# Altium schematic sheet Sheet1.SchDoc
size A; SheetNumber: 1; SheetTotal: 5
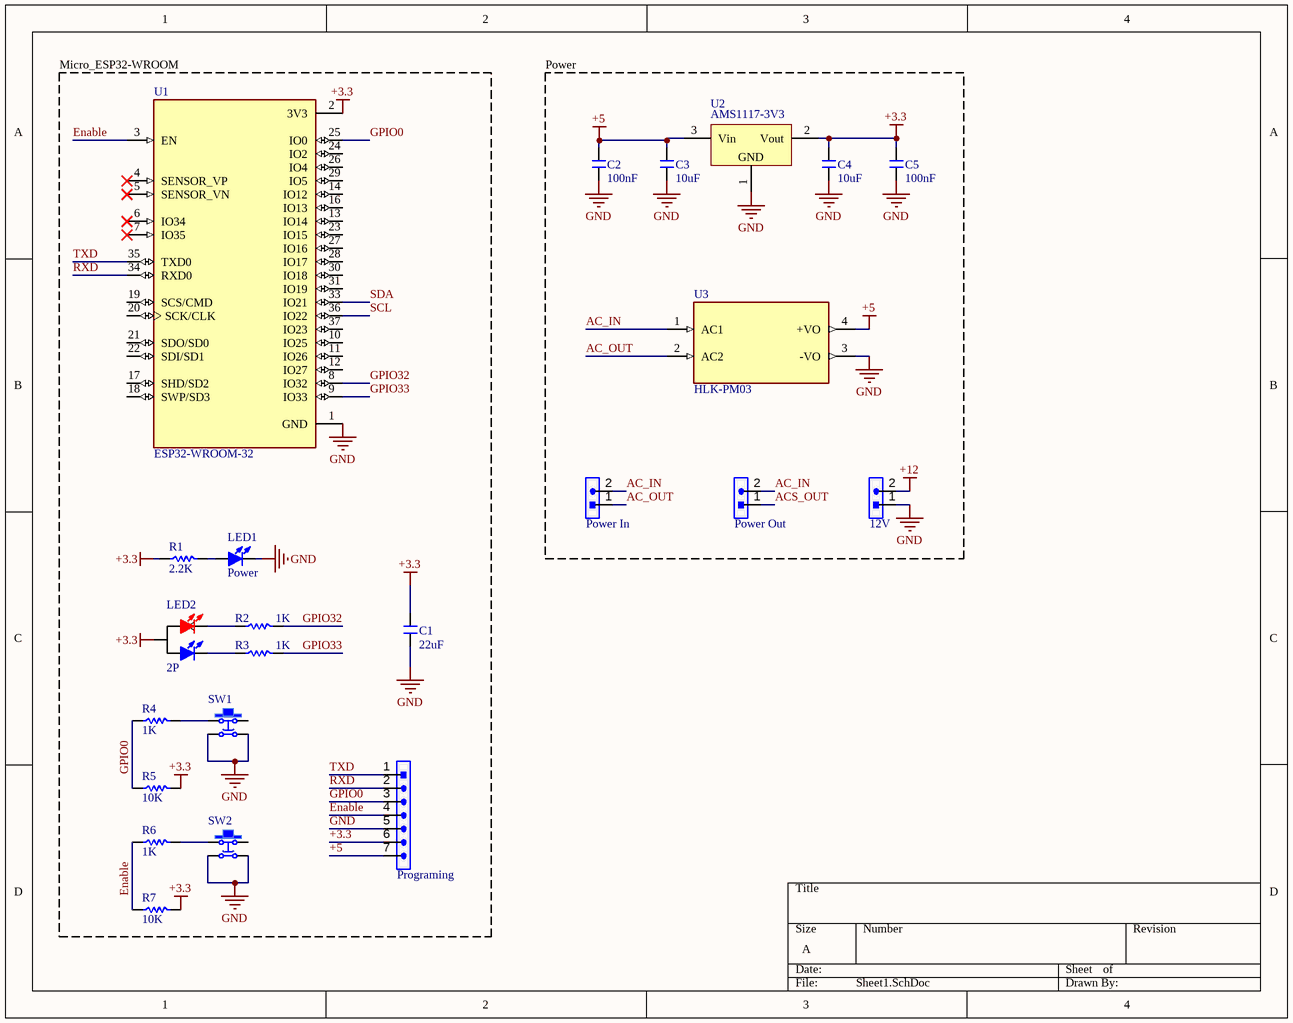
[diagram p0: Sheet1.SchDoc]

## Parts
12V  HDR-1X2  [KF301-2P]  (value not drawn)
C1  22uF  [C 0805]
C2  100nF  [C 0805]
C3  10uF  [C 0805]
C4  10uF  [C 0805]
C5  100nF  [C 0805]
LED1  Power  [LED 0805R]
LED2  2P  [LED 3mm-2P]
Power_In  HDR-1X2  [KF301-2P]  (value not drawn)
Power_Out  HDR-1X2  [KF301-2P]  (value not drawn)
Programing  HDR-1X7  [HDR-1X7]  (value not drawn)
R1  2.2K  [R 0805]
R2  1K  [R 0805]
R3  1K  [R 0805]
R4  1K  [R 0805]
R5  10K  [R 0805]
R6  1K  [R 0805]
R7  10K  [R 0805]
SW1  6x6x5  [TSW DIP-6*6*11]  (value not drawn)
SW2  6x6x5  [TSW DIP-6*6*11]  (value not drawn)
U1  ESP32-WROOM-32  [MODULE_ESP32-WROOM-32]
U2  AMS1117-3V3  [SOT223_L]
U3  HLK-PM03  [CONV_HLK-PM03]

## Nets
+3.3: C1.1 C4.2 C5.2 LED2.1 Programing.6 R1.1 R5.2 R7.2 U1.2(3V3) U2.2(Vout)
+5: C2.2 C3.2 Programing.7 U2.3(Vin) U3.4(+VO)
+12: 12V.2
GND: 12V.1 C1.2 C2.1 C3.1 C4.1 C5.1 LED1.2(K) Programing.5 SW1.2 SW1.3 SW2.2 SW2.3 U1.1(GND) U2.1(GND) U3.3(-VO)
AC_IN: Power_In.2 Power_Out.2 U3.1(AC1)
AC_OUT: Power_In.1 U3.2(AC2)
ACS_OUT: Power_Out.1
Enable: Programing.4 R6.1 R7.1 U1.3(EN)
GPIO0: Programing.3 R4.1 R5.1 U1.25(IO0)
GPIO32: R2.2 U1.8(IO32)
GPIO33: R3.2 U1.9(IO33)
RXD: Programing.2 U1.34(RXD0)
SCL: U1.36(IO22)
SDA: U1.33(IO21)
TXD: Programing.1 U1.35(TXD0)
NetLED1_1: LED1.1(A) R1.2
NetLED2_2: LED2.2 R2.1
NetLED2_3: LED2.3 R3.1
NetR4_2: R4.2 SW1.1
NetR6_2: R6.2 SW2.1

Not connected (* = marked no-connect by the designer): SW1 4; SW2 4; U1 4(SENSOR_VP)* 5(SENSOR_VN)* 6(IO34)* 7(IO35)* 10(IO25) 11(IO26) 12(IO27) 13(IO14) 14(IO12) 16(IO13) 17(SHD/SD2) 18(SWP/SD3) 19(SCS/CMD) 20(SCK/CLK) 21(SDO/SD0) 22(SDI/SD1) 23(IO15) 24(IO2) 26(IO4) 27(IO16) 28(IO17) 29(IO5) 30(IO18) 31(IO19) 37(IO23)

## Notes on the sheet
- (near U1) Micro_ESP32-WROOM
- Power

## Library data of the parts
12V Power_In Power_Out = Header 2: 2P Connector; BOM名称: 2P接插件; 版权归属: 源创客; 学习资源: www.ooocke.com
C1-C5 = C: Non-polar patch capacitor; BOM名称: 无极性贴片电容; 版权归属: 源创客; 学习资源: www.ooocke.com
LED1 = LED-SMD: RED LED; BOM名称: 贴片LED; 版权归属: 源创客; 学习资源: www.ooocke.com
LED2 = LED RG-A: two-color LED Anode; BOM名称: 共阳双色LED; 版权归属: 源创客; 学习资源: www.ooocke.com
Programing = Header 7: 7P Connector; BOM名称: 7P接插件; 版权归属: 源创客; 学习资源: www.ooocke.com
R1-R7 = R: Chip resistor; 版权归属: 源创客; BOM名称: Chip resistor; 学习资源: www.ooocke.com
SW1 SW2 = TSW DIP-6x6: Straight plug 6x6 tact switch; BOM名称: 直插6x6轻触开关; 版权归属: 源创客; 学习资源: www.ooocke.com
U1 = ESP32-WROOM-32: Bluetooth, WiFi Transceiver Module 2.4GHz ~ 2.5GHz Surface Mount; MF: Espressif Systems; Package: Module Espressif Systems; Digi-Key_Part_Number: 1904-1010-1-ND; Digi-Key_Purchase_URL: https://www.digikey.com/product-detail/en/espressif-systems/ESP32-WROOM-32/1904-1010-1-ND/8544305?utm_source=snapeda&utm_medium=aggregator&utm_campaign=symbol; Value: *; MP: ESP32-WROOM-32; SnapEDA_Link: https://www.snapeda.com/parts/ESP32-WROOM-32/Espressif%20Systems/view-part/2753322/?ref=snap
U2 = AMS1117: Three-terminal regulator chip; BOM名称: 稳压芯片; 版权归属: 源创客; 学习资源: www.ooocke.com
U3 = HLK-PM03: AC DC 3W power module; MF: Hi-link; Package: Package; Availability: Unavailable; SnapEDA_Link: https://www.snapeda.com/parts/HLK-PM03/Hi-link/view-part/3215695/?ref=snap; MP: HLK-PM03; Price: None; Value: *; BuyPart: https://www.snapeda.com/parts/HLK-PM03/Hi-link/view-part/3215695/?ref=eda